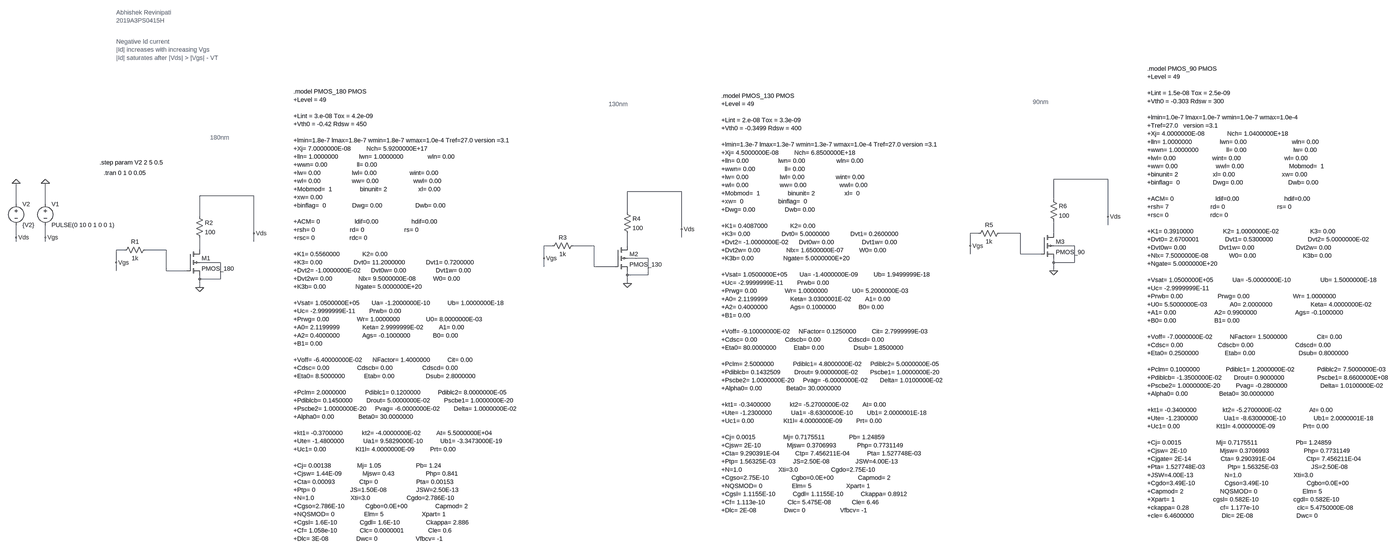
[diagram p0: schematic 2019A3PS0415H_E4Q2.asc, whole sheet]
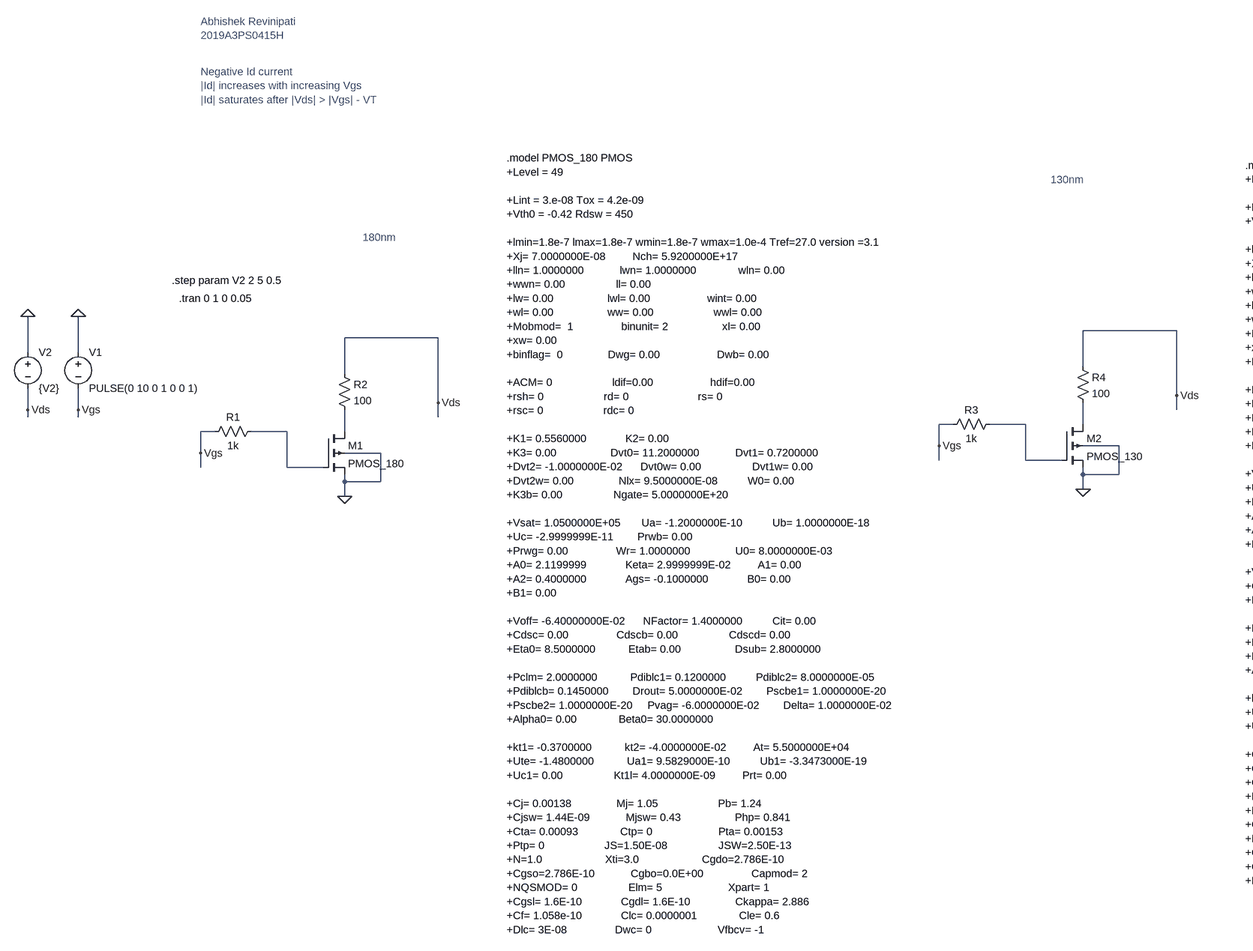
[diagram p1: schematic 2019A3PS0415H_E4Q2.asc, part, row 1 of 1, column 1 of 2]
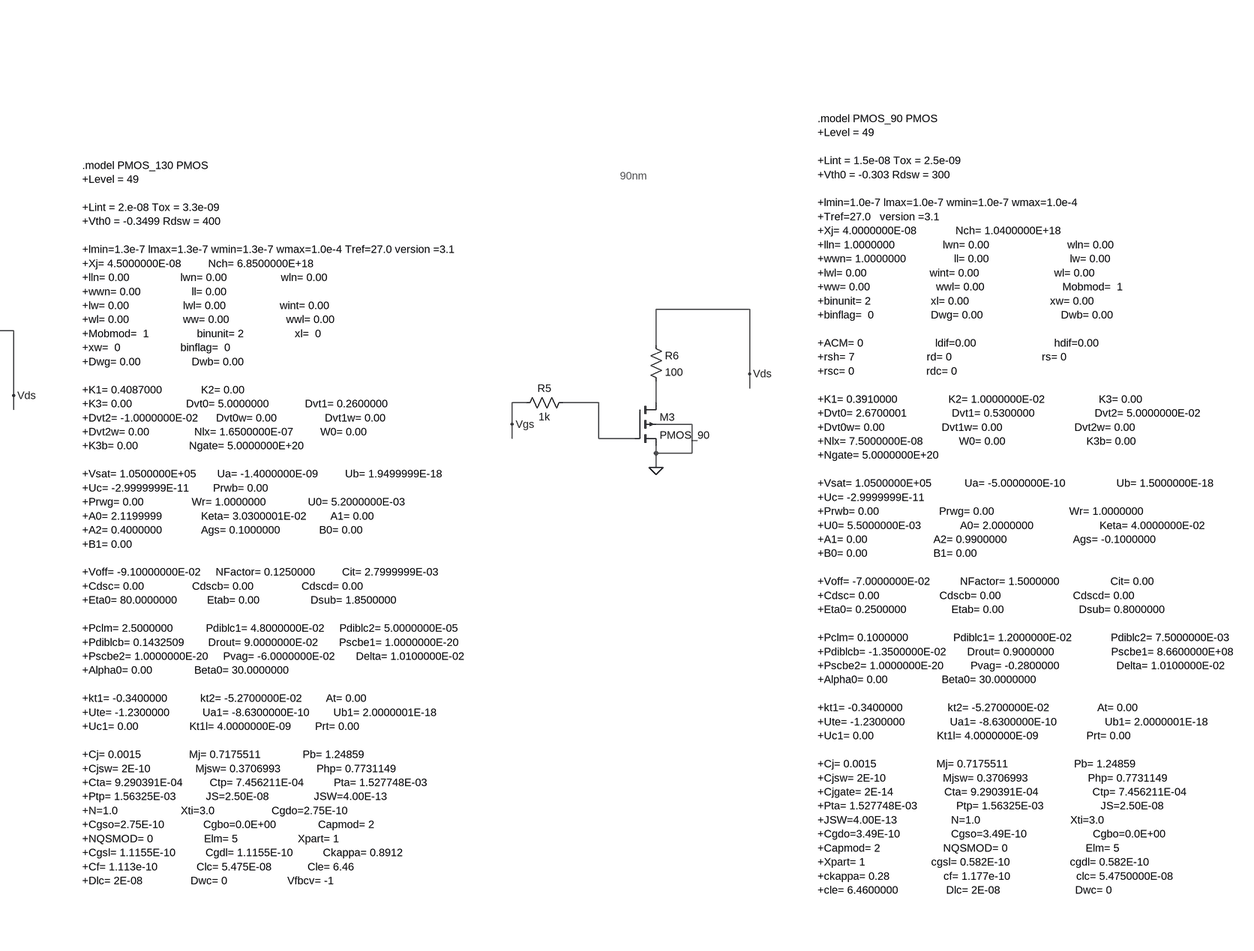
[diagram p2: schematic 2019A3PS0415H_E4Q2.asc, part, row 1 of 1, column 2 of 2]
2019A3PS0415H_E4Q2.asc, the LTspice schematic file:
Version 4
SHEET 1 5968 1152
WIRE 4656 -176 4448 -176
WIRE 2512 -128 2304 -128
WIRE 464 -112 256 -112
WIRE 4448 -96 4448 -176
WIRE -448 -80 -448 -160
WIRE -336 -80 -336 -160
WIRE 2304 -48 2304 -128
WIRE 256 -32 256 -112
WIRE 4656 -32 4656 -176
WIRE 4656 0 4656 -32
WIRE 2512 16 2512 -128
WIRE 464 32 464 -112
WIRE 4160 32 4128 32
WIRE 4320 32 4240 32
WIRE 4448 32 4448 -16
WIRE -448 48 -448 0
WIRE -336 48 -336 0
WIRE 2512 48 2512 16
WIRE -448 64 -448 48
WIRE -336 64 -336 48
WIRE 464 64 464 32
WIRE 2016 80 1984 80
WIRE 2176 80 2096 80
WIRE 2304 80 2304 32
WIRE 4128 80 4128 32
WIRE 4528 80 4448 80
WIRE -32 96 -64 96
WIRE 128 96 48 96
WIRE 256 96 256 48
WIRE 4128 112 4128 80
WIRE 4320 112 4320 32
WIRE 4400 112 4320 112
WIRE 1984 128 1984 80
WIRE 2384 128 2304 128
WIRE -64 144 -64 96
WIRE 336 144 256 144
WIRE 4448 144 4448 128
WIRE 4528 144 4528 80
WIRE 4528 144 4448 144
WIRE 1984 160 1984 128
WIRE 2176 160 2176 80
WIRE 2256 160 2176 160
WIRE -64 176 -64 144
WIRE 128 176 128 96
WIRE 208 176 128 176
WIRE 4448 176 4448 144
WIRE 2304 192 2304 176
WIRE 2384 192 2384 128
WIRE 2384 192 2304 192
WIRE 256 208 256 192
WIRE 336 208 336 144
WIRE 336 208 256 208
WIRE 2304 224 2304 192
WIRE 256 240 256 208
FLAG -448 -160 0
FLAG 256 240 0
FLAG -336 -160 0
FLAG 2304 224 0
FLAG 4448 176 0
FLAG -64 144 Vgs
FLAG 464 32 Vds
FLAG 1984 128 Vgs
FLAG 4128 80 Vgs
FLAG 2512 16 Vds
FLAG 4656 -32 Vds
FLAG -448 48 Vds
FLAG -336 48 Vgs
SYMBOL res 64 80 R90
WINDOW 0 0 56 VBottom 2
WINDOW 3 32 56 VTop 2
SYMATTR InstName R1
SYMATTR Value 1k
SYMBOL voltage -336 -96 R0
WINDOW 123 0 0 Left 0
WINDOW 39 0 0 Left 0
SYMATTR InstName V1
SYMATTR Value PULSE(0 10 0 1 0 0 1)
SYMBOL res 240 -48 R0
SYMATTR InstName R2
SYMATTR Value 100
SYMBOL voltage -448 -96 R0
WINDOW 123 0 0 Left 0
WINDOW 39 0 0 Left 0
SYMATTR InstName V2
SYMATTR Value {V2}
SYMBOL res 2112 64 R90
WINDOW 0 0 56 VBottom 2
WINDOW 3 32 56 VTop 2
SYMATTR InstName R3
SYMATTR Value 1k
SYMBOL res 2288 -64 R0
SYMATTR InstName R4
SYMATTR Value 100
SYMBOL res 4256 16 R90
WINDOW 0 0 56 VBottom 2
WINDOW 3 32 56 VTop 2
SYMATTR InstName R5
SYMATTR Value 1k
SYMBOL res 4432 -112 R0
SYMATTR InstName R6
SYMATTR Value 100
SYMBOL pmos4 208 96 R0
SYMATTR InstName M1
SYMATTR Value PMOS_180
SYMBOL pmos4 2256 80 R0
SYMATTR InstName M2
SYMATTR Value PMOS_130
SYMBOL pmos4 4400 32 R0
SYMATTR InstName M3
SYMATTR Value PMOS_90
TEXT 848 -512 Left 2 !.model PMOS_180 PMOS\n+Level = 49\n \n+Lint = 3.e-08 Tox = 4.2e-09 \n+Vth0 = -0.42 Rdsw = 450 \n \n+lmin=1.8e-7 lmax=1.8e-7 wmin=1.8e-7 wmax=1.0e-4 Tref=27.0 version =3.1\n+Xj= 7.0000000E-08         Nch= 5.9200000E+17 \n+lln= 1.0000000            lwn= 1.0000000              wln= 0.00\n+wwn= 0.00                 ll= 0.00\n+lw= 0.00                  lwl= 0.00                   wint= 0.00\n+wl= 0.00                  ww= 0.00                    wwl= 0.00\n+Mobmod=  1                binunit= 2                  xl= 0.00\n+xw= 0.00                  \n+binflag=  0               Dwg= 0.00                   Dwb= 0.00 \n \n+ACM= 0                    ldif=0.00                   hdif=0.00\n+rsh= 0                    rd= 0                       rs= 0\n+rsc= 0                    rdc= 0\n \n+K1= 0.5560000             K2= 0.00 \n+K3= 0.00                  Dvt0= 11.2000000            Dvt1= 0.7200000 \n+Dvt2= -1.0000000E-02      Dvt0w= 0.00                 Dvt1w= 0.00 \n+Dvt2w= 0.00               Nlx= 9.5000000E-08          W0= 0.00 \n+K3b= 0.00                 Ngate= 5.0000000E+20 \n \n+Vsat= 1.0500000E+05       Ua= -1.2000000E-10          Ub= 1.0000000E-18 \n+Uc= -2.9999999E-11        Prwb= 0.00 \n+Prwg= 0.00                Wr= 1.0000000               U0= 8.0000000E-03 \n+A0= 2.1199999             Keta= 2.9999999E-02         A1= 0.00 \n+A2= 0.4000000             Ags= -0.1000000             B0= 0.00 \n+B1= 0.00 \n \n+Voff= -6.40000000E-02      NFactor= 1.4000000          Cit= 0.00 \n+Cdsc= 0.00                Cdscb= 0.00                 Cdscd= 0.00 \n+Eta0= 8.5000000           Etab= 0.00                  Dsub= 2.8000000 \n \n+Pclm= 2.0000000           Pdiblc1= 0.1200000          Pdiblc2= 8.0000000E-05 \n+Pdiblcb= 0.1450000        Drout= 5.0000000E-02        Pscbe1= 1.0000000E-20 \n+Pscbe2= 1.0000000E-20     Pvag= -6.0000000E-02        Delta= 1.0000000E-02 \n+Alpha0= 0.00              Beta0= 30.0000000 \n \n+kt1= -0.3700000           kt2= -4.0000000E-02         At= 5.5000000E+04 \n+Ute= -1.4800000           Ua1= 9.5829000E-10          Ub1= -3.3473000E-19 \n+Uc1= 0.00                 Kt1l= 4.0000000E-09         Prt= 0.00 \n \n+Cj= 0.00138               Mj= 1.05                    Pb= 1.24\n+Cjsw= 1.44E-09            Mjsw= 0.43                  Php= 0.841\n+Cta= 0.00093              Ctp= 0                      Pta= 0.00153\n+Ptp= 0                    JS=1.50E-08                 JSW=2.50E-13\n+N=1.0                     Xti=3.0                     Cgdo=2.786E-10\n+Cgso=2.786E-10            Cgbo=0.0E+00                Capmod= 2\n+NQSMOD= 0                 Elm= 5                      Xpart= 1\n+Cgsl= 1.6E-10             Cgdl= 1.6E-10               Ckappa= 2.886\n+Cf= 1.058e-10             Clc= 0.0000001              Cle= 0.6\n+Dlc= 3E-08                Dwc= 0                      Vfbcv= -1
TEXT 2816 -496 Left 2 !.model PMOS_130 PMOS\n+Level = 49\n \n+Lint = 2.e-08 Tox = 3.3e-09 \n+Vth0 = -0.3499 Rdsw = 400 \n \n+lmin=1.3e-7 lmax=1.3e-7 wmin=1.3e-7 wmax=1.0e-4 Tref=27.0 version =3.1\n+Xj= 4.5000000E-08         Nch= 6.8500000E+18 \n+lln= 0.00                 lwn= 0.00                  wln= 0.00\n+wwn= 0.00                 ll= 0.00\n+lw= 0.00                  lwl= 0.00                  wint= 0.00\n+wl= 0.00                  ww= 0.00                   wwl= 0.00\n+Mobmod=  1                binunit= 2                 xl=  0\n+xw=  0                    binflag=  0\n+Dwg= 0.00                 Dwb= 0.00 \n \n+K1= 0.4087000             K2= 0.00 \n+K3= 0.00                  Dvt0= 5.0000000            Dvt1= 0.2600000 \n+Dvt2= -1.0000000E-02      Dvt0w= 0.00                Dvt1w= 0.00 \n+Dvt2w= 0.00               Nlx= 1.6500000E-07         W0= 0.00 \n+K3b= 0.00                 Ngate= 5.0000000E+20 \n \n+Vsat= 1.0500000E+05       Ua= -1.4000000E-09         Ub= 1.9499999E-18 \n+Uc= -2.9999999E-11        Prwb= 0.00 \n+Prwg= 0.00                Wr= 1.0000000              U0= 5.2000000E-03 \n+A0= 2.1199999             Keta= 3.0300001E-02        A1= 0.00 \n+A2= 0.4000000             Ags= 0.1000000             B0= 0.00 \n+B1= 0.00 \n \n+Voff= -9.10000000E-02     NFactor= 0.1250000         Cit= 2.7999999E-03 \n+Cdsc= 0.00                Cdscb= 0.00                Cdscd= 0.00 \n+Eta0= 80.0000000          Etab= 0.00                 Dsub= 1.8500000 \n \n+Pclm= 2.5000000           Pdiblc1= 4.8000000E-02     Pdiblc2= 5.0000000E-05 \n+Pdiblcb= 0.1432509        Drout= 9.0000000E-02       Pscbe1= 1.0000000E-20 \n+Pscbe2= 1.0000000E-20     Pvag= -6.0000000E-02       Delta= 1.0100000E-02 \n+Alpha0= 0.00              Beta0= 30.0000000 \n \n+kt1= -0.3400000           kt2= -5.2700000E-02        At= 0.00 \n+Ute= -1.2300000           Ua1= -8.6300000E-10        Ub1= 2.0000001E-18 \n+Uc1= 0.00                 Kt1l= 4.0000000E-09        Prt= 0.00 \n \n+Cj= 0.0015                Mj= 0.7175511              Pb= 1.24859\n+Cjsw= 2E-10               Mjsw= 0.3706993            Php= 0.7731149\n+Cta= 9.290391E-04         Ctp= 7.456211E-04          Pta= 1.527748E-03\n+Ptp= 1.56325E-03          JS=2.50E-08               JSW=4.00E-13\n+N=1.0                     Xti=3.0                   Cgdo=2.75E-10\n+Cgso=2.75E-10             Cgbo=0.0E+00              Capmod= 2\n+NQSMOD= 0                 Elm= 5                    Xpart= 1\n+Cgsl= 1.1155E-10          Cgdl= 1.1155E-10          Ckappa= 0.8912\n+Cf= 1.113e-10             Clc= 5.475E-08            Cle= 6.46\n+Dlc= 2E-08                Dwc= 0                    Vfbcv= -1
TEXT 4952 -600 Left 2 !.model PMOS_90 PMOS\n+Level = 49\n \n+Lint = 1.5e-08 Tox = 2.5e-09 \n+Vth0 = -0.303 Rdsw = 300 \n \n+lmin=1.0e-7 lmax=1.0e-7 wmin=1.0e-7 wmax=1.0e-4\n+Tref=27.0   version =3.1\n+Xj= 4.0000000E-08             Nch= 1.0400000E+18 \n+lln= 1.0000000                lwn= 0.00                          wln= 0.00\n+wwn= 1.0000000                ll= 0.00                           lw= 0.00\n+lwl= 0.00                     wint= 0.00                         wl= 0.00\n+ww= 0.00                      wwl= 0.00                          Mobmod=  1\n+binunit= 2                    xl= 0.00                           xw= 0.00\n+binflag=  0                   Dwg= 0.00                          Dwb= 0.00\n \n+ACM= 0                        ldif=0.00                          hdif=0.00\n+rsh= 7                        rd= 0                              rs= 0\n+rsc= 0                        rdc= 0\n \n+K1= 0.3910000                 K2= 1.0000000E-02                  K3= 0.00 \n+Dvt0= 2.6700001               Dvt1= 0.5300000                    Dvt2= 5.0000000E-02 \n+Dvt0w= 0.00                   Dvt1w= 0.00                        Dvt2w= 0.00 \n+Nlx= 7.5000000E-08            W0= 0.00                           K3b= 0.00 \n+Ngate= 5.0000000E+20 \n \n+Vsat= 1.0500000E+05           Ua= -5.0000000E-10                 Ub= 1.5000000E-18\n+Uc= -2.9999999E-11  \n+Prwb= 0.00                    Prwg= 0.00                         Wr= 1.0000000 \n+U0= 5.5000000E-03             A0= 2.0000000                      Keta= 4.0000000E-02\n+A1= 0.00                      A2= 0.9900000                      Ags= -0.1000000 \n+B0= 0.00                      B1= 0.00 \n \n+Voff= -7.0000000E-02          NFactor= 1.5000000                 Cit= 0.00 \n+Cdsc= 0.00                    Cdscb= 0.00                        Cdscd= 0.00\n+Eta0= 0.2500000               Etab= 0.00                         Dsub= 0.8000000 \n \n+Pclm= 0.1000000               Pdiblc1= 1.2000000E-02             Pdiblc2= 7.5000000E-03 \n+Pdiblcb= -1.3500000E-02       Drout= 0.9000000                   Pscbe1= 8.6600000E+08 \n+Pscbe2= 1.0000000E-20         Pvag= -0.2800000                   Delta= 1.0100000E-02 \n+Alpha0= 0.00                  Beta0= 30.0000000 \n \n+kt1= -0.3400000               kt2= -5.2700000E-02                At= 0.00 \n+Ute= -1.2300000               Ua1= -8.6300000E-10                Ub1= 2.0000001E-18 \n+Uc1= 0.00                     Kt1l= 4.0000000E-09                Prt= 0.00 \n \n+Cj= 0.0015                    Mj= 0.7175511                      Pb= 1.24859\n+Cjsw= 2E-10                   Mjsw= 0.3706993                    Php= 0.7731149\n+Cjgate= 2E-14                 Cta= 9.290391E-04                  Ctp= 7.456211E-04\n+Pta= 1.527748E-03             Ptp= 1.56325E-03                   JS=2.50E-08\n+JSW=4.00E-13                  N=1.0                              Xti=3.0\n+Cgdo=3.49E-10                 Cgso=3.49E-10                      Cgbo=0.0E+00       \n+Capmod= 2                     NQSMOD= 0                          Elm= 5            \n+Xpart= 1                      cgsl= 0.582E-10                    cgdl= 0.582E-10\n+ckappa= 0.28                  cf= 1.177e-10                      clc= 5.4750000E-08 \n+cle= 6.4600000                Dlc= 2E-08                         Dwc= 0
TEXT 296 -336 Left 2 ;180nm
TEXT 2232 -464 Left 2 ;130nm
TEXT 4368 -472 Left 2 ;90nm
TEXT -64 -816 Left 2 ;Abhishek Revinipati\n2019A3PS0415H
TEXT -128 -240 Left 2 !.step param V2 2 5 0.5
TEXT -112 -200 Left 2 !.tran 0 1 0 0.05
TEXT -64 -704 Left 2 ;Negative Id current \n|Id| increases with increasing Vgs\n|Id| saturates after |Vds| > |Vgs| - VT

The netlist it stands for:
* 2019A3PS0415H_E4Q2.asc
R1 N005 Vgs 1k
V1 0 Vgs PULSE(0 10 0 1 0 0 1)
R2 Vds N006 100
V2 0 Vds {V2}
R3 N003 Vgs 1k
R4 Vds N004 100
R5 N001 Vgs 1k
R6 Vds N002 100
M1 N006 N005 0 0 PMOS_180
M2 N004 N003 0 0 PMOS_130
M3 N002 N001 0 0 PMOS_90
.model NMOS NMOS
.model PMOS PMOS
.lib standard.mos
.model PMOS_180 PMOS
+Level = 49
+Lint = 3.e-08 Tox = 4.2e-09
+Vth0 = -0.42 Rdsw = 450
+lmin=1.8e-7 lmax=1.8e-7 wmin=1.8e-7 wmax=1.0e-4 Tref=27.0 version =3.1
+Xj= 7.0000000E-08         Nch= 5.9200000E+17
+lln= 1.0000000            lwn= 1.0000000              wln= 0.00
+wwn= 0.00                 ll= 0.00
+lw= 0.00                  lwl= 0.00                   wint= 0.00
+wl= 0.00                  ww= 0.00                    wwl= 0.00
+Mobmod=  1                binunit= 2                  xl= 0.00
+xw= 0.00
+binflag=  0               Dwg= 0.00                   Dwb= 0.00
+ACM= 0                    ldif=0.00                   hdif=0.00
+rsh= 0                    rd= 0                       rs= 0
+rsc= 0                    rdc= 0
+K1= 0.5560000             K2= 0.00
+K3= 0.00                  Dvt0= 11.2000000            Dvt1= 0.7200000
+Dvt2= -1.0000000E-02      Dvt0w= 0.00                 Dvt1w= 0.00
+Dvt2w= 0.00               Nlx= 9.5000000E-08          W0= 0.00
+K3b= 0.00                 Ngate= 5.0000000E+20
+Vsat= 1.0500000E+05       Ua= -1.2000000E-10          Ub= 1.0000000E-18
+Uc= -2.9999999E-11        Prwb= 0.00
+Prwg= 0.00                Wr= 1.0000000               U0= 8.0000000E-03
+A0= 2.1199999             Keta= 2.9999999E-02         A1= 0.00
+A2= 0.4000000             Ags= -0.1000000             B0= 0.00
+B1= 0.00
+Voff= -6.40000000E-02      NFactor= 1.4000000          Cit= 0.00
+Cdsc= 0.00                Cdscb= 0.00                 Cdscd= 0.00
+Eta0= 8.5000000           Etab= 0.00                  Dsub= 2.8000000
+Pclm= 2.0000000           Pdiblc1= 0.1200000          Pdiblc2= 8.0000000E-05
+Pdiblcb= 0.1450000        Drout= 5.0000000E-02        Pscbe1= 1.0000000E-20
+Pscbe2= 1.0000000E-20     Pvag= -6.0000000E-02        Delta= 1.0000000E-02
+Alpha0= 0.00              Beta0= 30.0000000
+kt1= -0.3700000           kt2= -4.0000000E-02         At= 5.5000000E+04
+Ute= -1.4800000           Ua1= 9.5829000E-10          Ub1= -3.3473000E-19
+Uc1= 0.00                 Kt1l= 4.0000000E-09         Prt= 0.00
+Cj= 0.00138               Mj= 1.05                    Pb= 1.24
+Cjsw= 1.44E-09            Mjsw= 0.43                  Php= 0.841
+Cta= 0.00093              Ctp= 0                      Pta= 0.00153
+Ptp= 0                    JS=1.50E-08                 JSW=2.50E-13
+N=1.0                     Xti=3.0                     Cgdo=2.786E-10
+Cgso=2.786E-10            Cgbo=0.0E+00                Capmod= 2
+NQSMOD= 0                 Elm= 5                      Xpart= 1
+Cgsl= 1.6E-10             Cgdl= 1.6E-10               Ckappa= 2.886
+Cf= 1.058e-10             Clc= 0.0000001              Cle= 0.6
+Dlc= 3E-08                Dwc= 0                      Vfbcv= -1
.model PMOS_130 PMOS
+Level = 49
+Lint = 2.e-08 Tox = 3.3e-09
+Vth0 = -0.3499 Rdsw = 400
+lmin=1.3e-7 lmax=1.3e-7 wmin=1.3e-7 wmax=1.0e-4 Tref=27.0 version =3.1
+Xj= 4.5000000E-08         Nch= 6.8500000E+18
+lln= 0.00                 lwn= 0.00                  wln= 0.00
+wwn= 0.00                 ll= 0.00
+lw= 0.00                  lwl= 0.00                  wint= 0.00
+wl= 0.00                  ww= 0.00                   wwl= 0.00
+Mobmod=  1                binunit= 2                 xl=  0
+xw=  0                    binflag=  0
+Dwg= 0.00                 Dwb= 0.00
+K1= 0.4087000             K2= 0.00
+K3= 0.00                  Dvt0= 5.0000000            Dvt1= 0.2600000
+Dvt2= -1.0000000E-02      Dvt0w= 0.00                Dvt1w= 0.00
+Dvt2w= 0.00               Nlx= 1.6500000E-07         W0= 0.00
+K3b= 0.00                 Ngate= 5.0000000E+20
+Vsat= 1.0500000E+05       Ua= -1.4000000E-09         Ub= 1.9499999E-18
+Uc= -2.9999999E-11        Prwb= 0.00
+Prwg= 0.00                Wr= 1.0000000              U0= 5.2000000E-03
+A0= 2.1199999             Keta= 3.0300001E-02        A1= 0.00
+A2= 0.4000000             Ags= 0.1000000             B0= 0.00
+B1= 0.00
+Voff= -9.10000000E-02     NFactor= 0.1250000         Cit= 2.7999999E-03
+Cdsc= 0.00                Cdscb= 0.00                Cdscd= 0.00
+Eta0= 80.0000000          Etab= 0.00                 Dsub= 1.8500000
+Pclm= 2.5000000           Pdiblc1= 4.8000000E-02     Pdiblc2= 5.0000000E-05
+Pdiblcb= 0.1432509        Drout= 9.0000000E-02       Pscbe1= 1.0000000E-20
+Pscbe2= 1.0000000E-20     Pvag= -6.0000000E-02       Delta= 1.0100000E-02
+Alpha0= 0.00              Beta0= 30.0000000
+kt1= -0.3400000           kt2= -5.2700000E-02        At= 0.00
+Ute= -1.2300000           Ua1= -8.6300000E-10        Ub1= 2.0000001E-18
+Uc1= 0.00                 Kt1l= 4.0000000E-09        Prt= 0.00
+Cj= 0.0015                Mj= 0.7175511              Pb= 1.24859
+Cjsw= 2E-10               Mjsw= 0.3706993            Php= 0.7731149
+Cta= 9.290391E-04         Ctp= 7.456211E-04          Pta= 1.527748E-03
+Ptp= 1.56325E-03          JS=2.50E-08               JSW=4.00E-13
+N=1.0                     Xti=3.0                   Cgdo=2.75E-10
+Cgso=2.75E-10             Cgbo=0.0E+00              Capmod= 2
+NQSMOD= 0                 Elm= 5                    Xpart= 1
+Cgsl= 1.1155E-10          Cgdl= 1.1155E-10          Ckappa= 0.8912
+Cf= 1.113e-10             Clc= 5.475E-08            Cle= 6.46
+Dlc= 2E-08                Dwc= 0                    Vfbcv= -1
.model PMOS_90 PMOS
+Level = 49
+Lint = 1.5e-08 Tox = 2.5e-09
+Vth0 = -0.303 Rdsw = 300
+lmin=1.0e-7 lmax=1.0e-7 wmin=1.0e-7 wmax=1.0e-4
+Tref=27.0   version =3.1
+Xj= 4.0000000E-08             Nch= 1.0400000E+18
+lln= 1.0000000                lwn= 0.00                          wln= 0.00
+wwn= 1.0000000                ll= 0.00                           lw= 0.00
+lwl= 0.00                     wint= 0.00                         wl= 0.00
+ww= 0.00                      wwl= 0.00                          Mobmod=  1
+binunit= 2                    xl= 0.00                           xw= 0.00
+binflag=  0                   Dwg= 0.00                          Dwb= 0.00
+ACM= 0                        ldif=0.00                          hdif=0.00
+rsh= 7                        rd= 0                              rs= 0
+rsc= 0                        rdc= 0
+K1= 0.3910000                 K2= 1.0000000E-02                  K3= 0.00
+Dvt0= 2.6700001               Dvt1= 0.5300000                    Dvt2= 5.0000000E-02
+Dvt0w= 0.00                   Dvt1w= 0.00                        Dvt2w= 0.00
+Nlx= 7.5000000E-08            W0= 0.00                           K3b= 0.00
+Ngate= 5.0000000E+20
+Vsat= 1.0500000E+05           Ua= -5.0000000E-10                 Ub= 1.5000000E-18
+Uc= -2.9999999E-11
+Prwb= 0.00                    Prwg= 0.00                         Wr= 1.0000000
+U0= 5.5000000E-03             A0= 2.0000000                      Keta= 4.0000000E-02
+A1= 0.00                      A2= 0.9900000                      Ags= -0.1000000
+B0= 0.00                      B1= 0.00
+Voff= -7.0000000E-02          NFactor= 1.5000000                 Cit= 0.00
+Cdsc= 0.00                    Cdscb= 0.00                        Cdscd= 0.00
+Eta0= 0.2500000               Etab= 0.00                         Dsub= 0.8000000
+Pclm= 0.1000000               Pdiblc1= 1.2000000E-02             Pdiblc2= 7.5000000E-03
+Pdiblcb= -1.3500000E-02       Drout= 0.9000000                   Pscbe1= 8.6600000E+08
+Pscbe2= 1.0000000E-20         Pvag= -0.2800000                   Delta= 1.0100000E-02
+Alpha0= 0.00                  Beta0= 30.0000000
+kt1= -0.3400000               kt2= -5.2700000E-02                At= 0.00
+Ute= -1.2300000               Ua1= -8.6300000E-10                Ub1= 2.0000001E-18
+Uc1= 0.00                     Kt1l= 4.0000000E-09                Prt= 0.00
+Cj= 0.0015                    Mj= 0.7175511                      Pb= 1.24859
+Cjsw= 2E-10                   Mjsw= 0.3706993                    Php= 0.7731149
+Cjgate= 2E-14                 Cta= 9.290391E-04                  Ctp= 7.456211E-04
+Pta= 1.527748E-03             Ptp= 1.56325E-03                   JS=2.50E-08
+JSW=4.00E-13                  N=1.0                              Xti=3.0
+Cgdo=3.49E-10                 Cgso=3.49E-10                      Cgbo=0.0E+00
+Capmod= 2                     NQSMOD= 0                          Elm= 5
+Xpart= 1                      cgsl= 0.582E-10                    cgdl= 0.582E-10
+ckappa= 0.28                  cf= 1.177e-10                      clc= 5.4750000E-08
+cle= 6.4600000                Dlc= 2E-08                         Dwc= 0
* 180nm
* 130nm
* 90nm
* Abhishek Revinipati
* 2019A3PS0415H
.step param V2 2 5 0.5
.tran 0 1 0 0.05
* Negative Id current
* |Id| increases with increasing Vgs
* |Id| saturates after |Vds| > |Vgs| - VT
.backanno
.end